# Altium schematic sheet PHENIKA.SchDoc
size A2; SheetNumber: 1; SheetTotal: 2
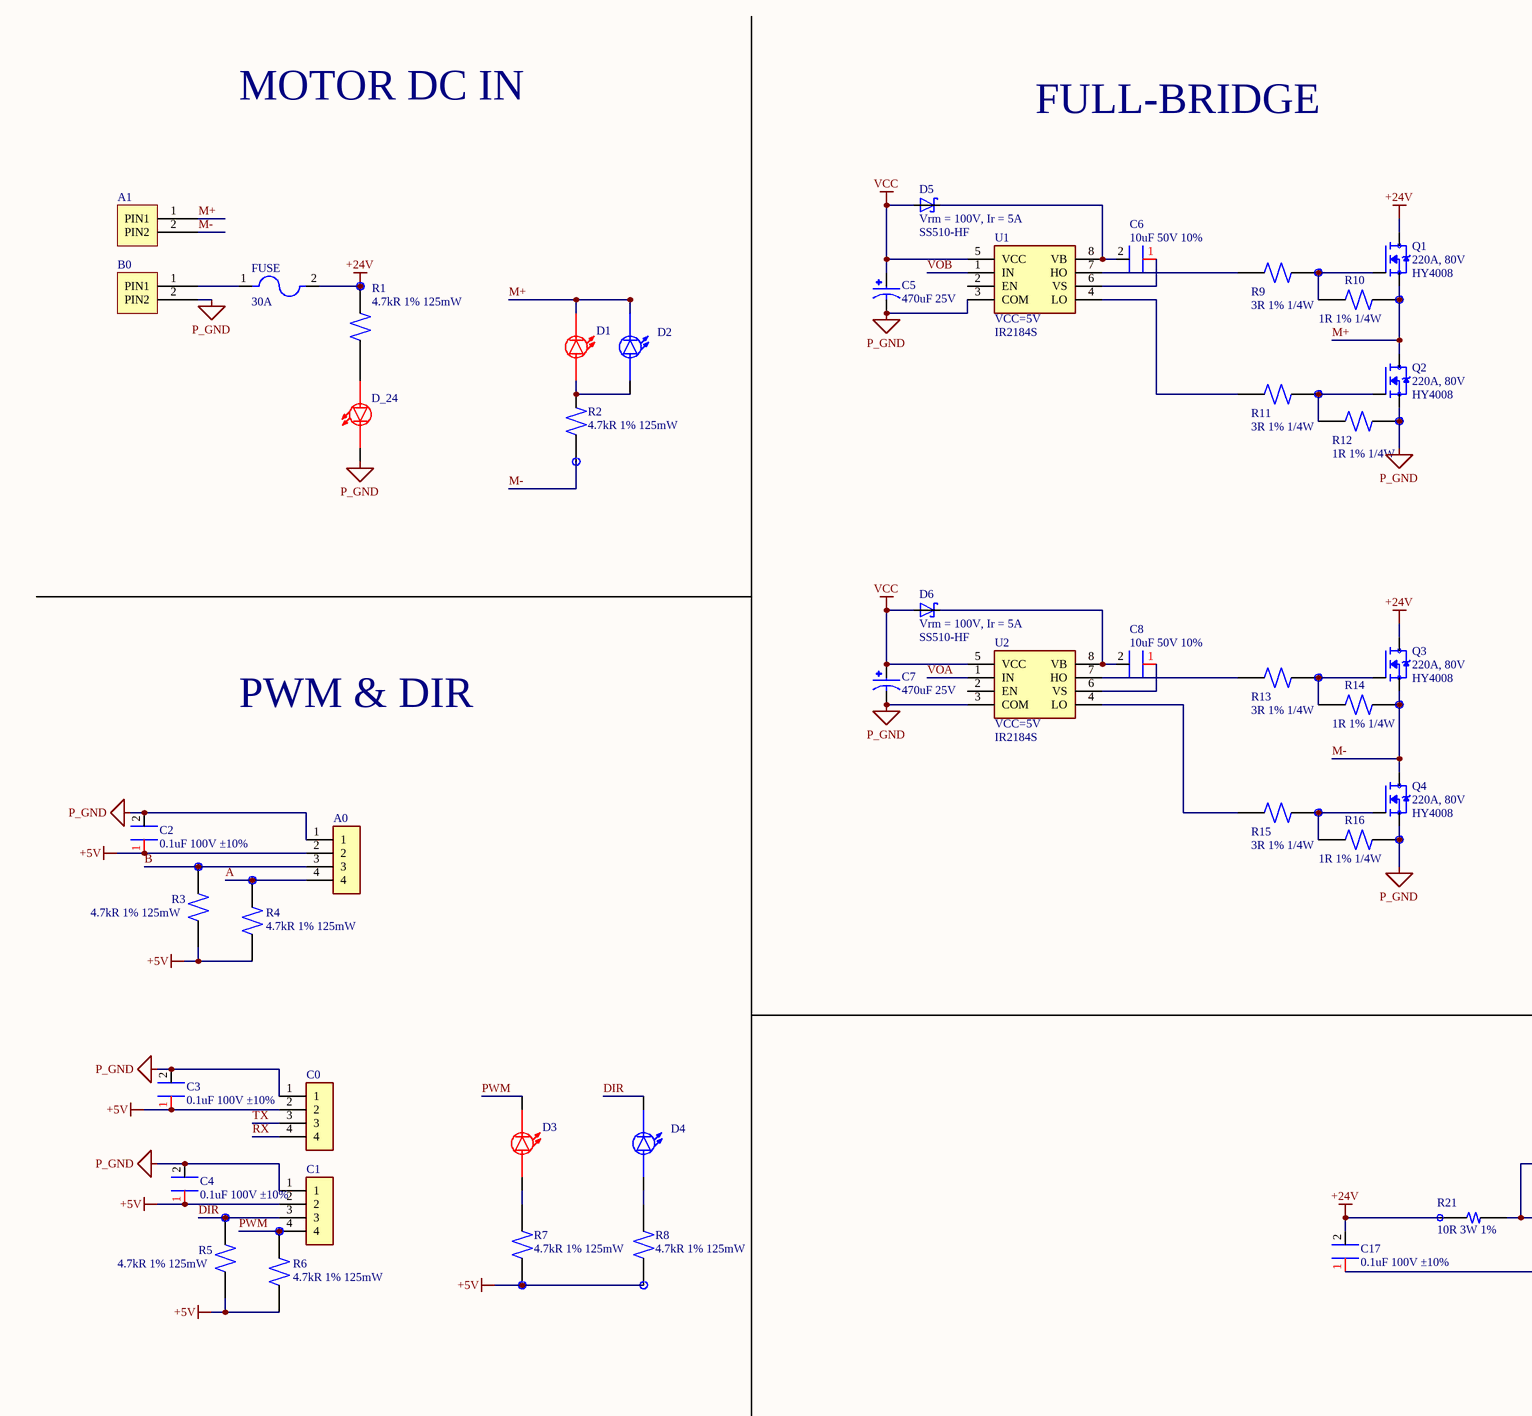
[diagram p0: PHENIKA.SchDoc, left]
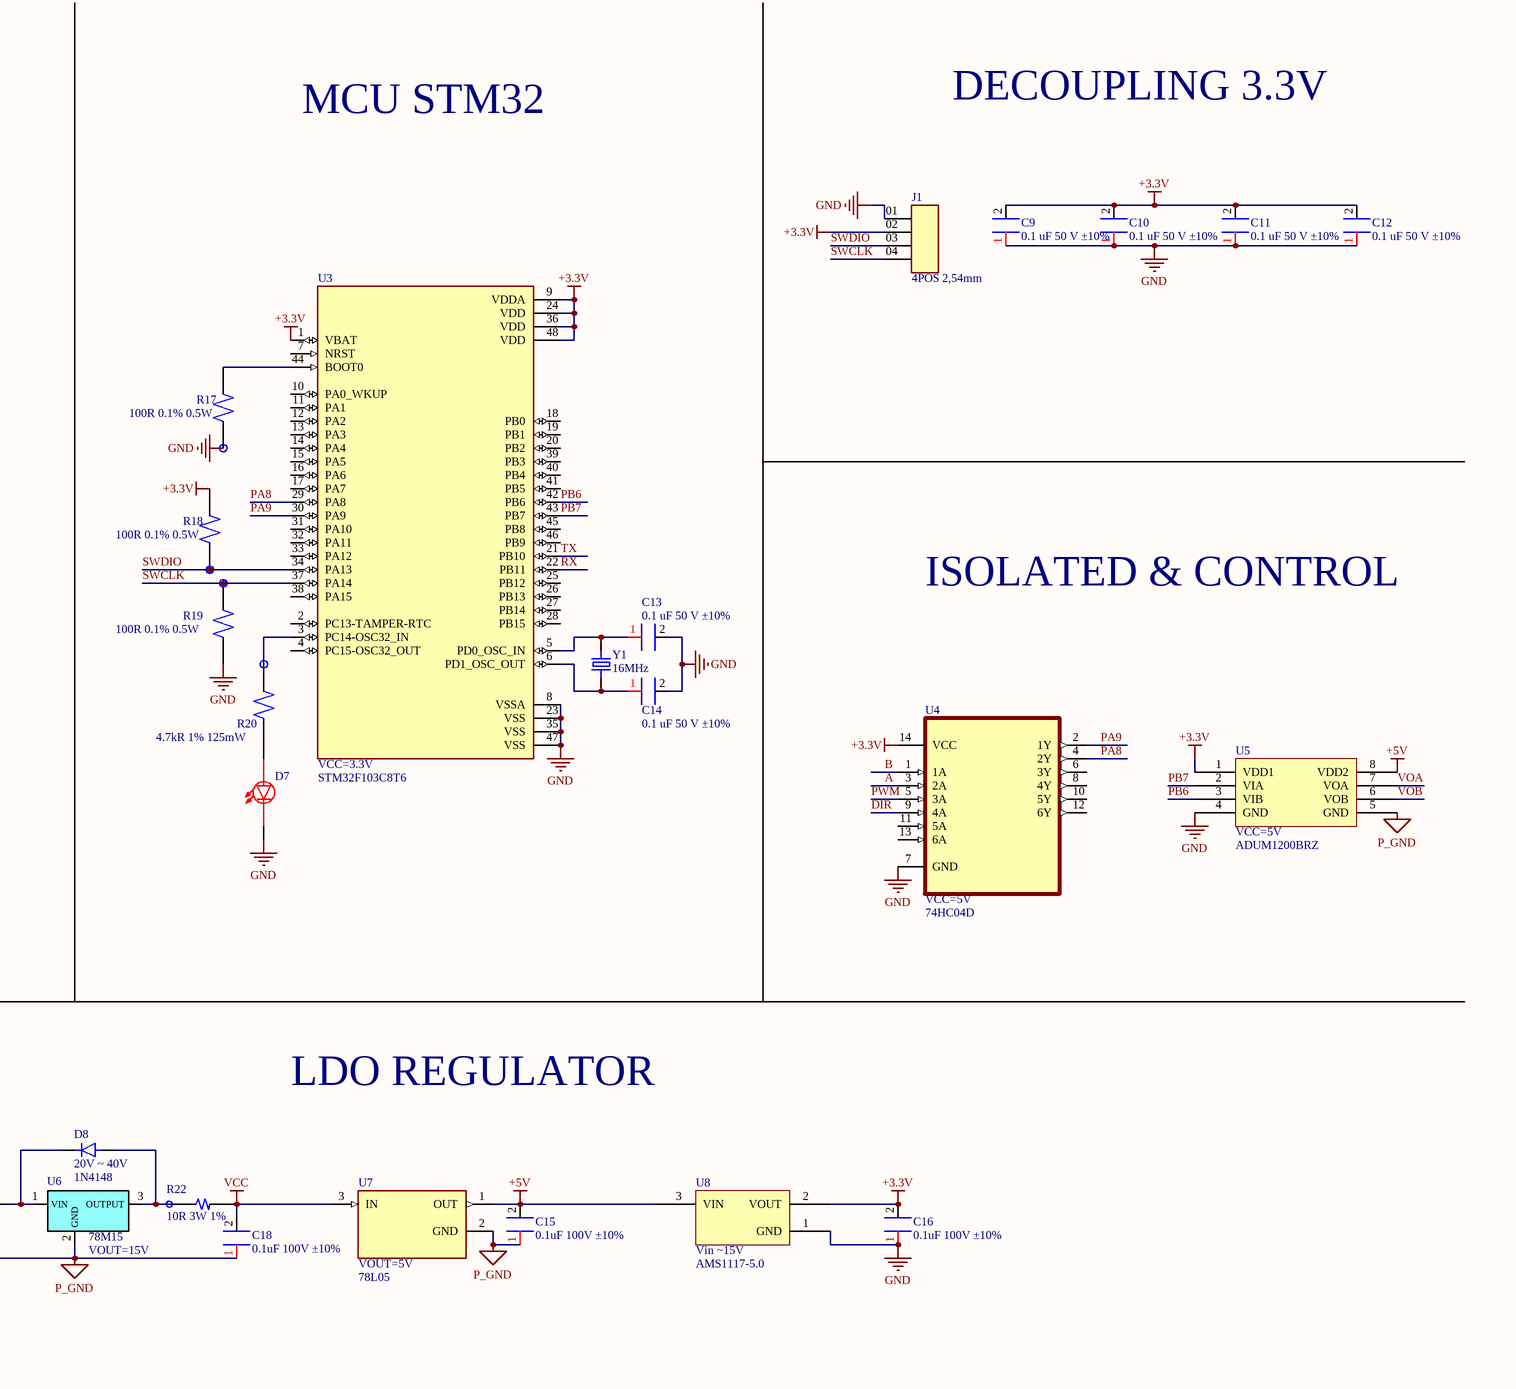
[diagram p1: PHENIKA.SchDoc, right]

## Parts
A0  4PIN 2.5 mm  [HEADER-4POS_CURVED_2.54mm]  (value not drawn)
A1  2PIN 2.54mm  [HEADER-CONN_2POS_2.54mm]  (value not drawn)
B0  2PIN 2.54mm  [HEADER-CONN_2POS_2.54mm]  (value not drawn)
C0  4PIN 2.5 mm  [HEADER-4POS_CURVED_2.54mm]  (value not drawn)
C1  4PIN 2.5 mm  [HEADER-4POS_CURVED_2.54mm]  (value not drawn)
C2  0.1uF 100V ±10%  [CAP-CER_1206 3.2x1.6x0.5mm SMD]
C3  0.1uF 100V ±10%  [CAP-CER_1206 3.2x1.6x0.5mm SMD]
C4  0.1uF 100V ±10%  [CAP-CER_1206 3.2x1.6x0.5mm SMD]
C5  470uF 25V  [CAP-POLARIZED TH 25V 3x5mm]
C6  10uF 50V 10%  [CAP-CER_0805 SMD 2.01x1.25mm]
C7  470uF 25V  [CAP-POLARIZED TH 25V 3x5mm]
C8  10uF 50V 10%  [CAP-CER_0805 SMD 2.01x1.25mm]
C9  0.1 uF 50 V ±10%  [CAP-CER_0805 SMD 2.01x1.25mm]
C10  0.1 uF 50 V ±10%  [CAP-CER_0805 SMD 2.01x1.25mm]
C11  0.1 uF 50 V ±10%  [CAP-CER_0805 SMD 2.01x1.25mm]
C12  0.1 uF 50 V ±10%  [CAP-CER_0805 SMD 2.01x1.25mm]
C13  0.1 uF 50 V ±10%  [CAP-CER_0805 SMD 2.01x1.25mm]
C14  0.1 uF 50 V ±10%  [CAP-CER_0805 SMD 2.01x1.25mm]
C15  0.1uF 100V ±10%  [CAP-CER_1206 3.2x1.6x0.5mm SMD]
C16  0.1uF 100V ±10%  [CAP-CER_1206 3.2x1.6x0.5mm SMD]
C17  0.1uF 100V ±10%  [CAP-CER_1206 3.2x1.6x0.5mm SMD]
C18  0.1uF 100V ±10%  [CAP-CER_1206 3.2x1.6x0.5mm SMD]
D1  XL-1608SURC-06  [DIODE-LED_SMD-XL-1608SURC-06 RED 1.25x1.14mm]  (value not drawn)
D2  LED BLUE  [DIODE-LED_SMD-LXT0805GW-TR 1.25X1.14MM]  (value not drawn)
D3  XL-1608SURC-06  [DIODE-LED_SMD-XL-1608SURC-06 RED 1.25x1.14mm]  (value not drawn)
D4  LED BLUE  [DIODE-LED_SMD-LXT0805GW-TR 1.25X1.14MM]  (value not drawn)
D5  Vrm = 100V, Ir = 5A  Manufacture Part Number Cross: SS510-HF  [DIODE_ES1J-DO214AC]
D6  Vrm = 100V, Ir = 5A  Manufacture Part Number Cross: SS510-HF  [DIODE_ES1J-DO214AC]
D7  XL-1608SURC-06  [DIODE-LED_SMD-XL-1608SURC-06 RED 1.25x1.14mm]  (value not drawn)
D8  20V ~ 40V  Manufacturer Part Number: 1N4148  [DIODE-SCHOTTKY_1N4148 5x2.4x1.2mm]
D_24  XL-1608SURC-06  [DIODE-LED_SMD-XL-1608SURC-06 RED 1.25x1.14mm]  (value not drawn)
FUSE  30A  [FUSE-30A-250V-DIP]
J1  4POS 2,54mm  [JUMP_4POS_TH_NO-BODY]  (no BOM)
Q1  220A, 80V  Manufacturer Part Number: HY4008  [MOSFET_N-CHANNEL_TO-263-2]
Q2  220A, 80V  Manufacturer Part Number: HY4008  [MOSFET_N-CHANNEL_TO-263-2]
Q3  220A, 80V  Manufacturer Part Number: HY4008  [MOSFET_N-CHANNEL_TO-263-2]
Q4  220A, 80V  Manufacturer Part Number: HY4008  [MOSFET_N-CHANNEL_TO-263-2]
R1  4.7kR 1% 125mW  [RES_0805 2x1.25mm]
R2  4.7kR 1% 125mW  [RES_0805 2x1.25mm]
R3  4.7kR 1% 125mW  [RES_0805 2x1.25mm]
R4  4.7kR 1% 125mW  [RES_0805 2x1.25mm]
R5  4.7kR 1% 125mW  [RES_0805 2x1.25mm]
R6  4.7kR 1% 125mW  [RES_0805 2x1.25mm]
R7  4.7kR 1% 125mW  [RES_0805 2x1.25mm]
R8  4.7kR 1% 125mW  [RES_0805 2x1.25mm]
R9  3R 1% 1/4W  [RES_0805 2x1.25mm]
R10  1R 1% 1/4W  [RES_0805 2x1.25mm]
R11  3R 1% 1/4W  [RES_0805 2x1.25mm]
R12  1R 1% 1/4W  [RES_0805 2x1.25mm]
R13  3R 1% 1/4W  [RES_0805 2x1.25mm]
R14  1R 1% 1/4W  [RES_0805 2x1.25mm]
R15  3R 1% 1/4W  [RES_0805 2x1.25mm]
R16  1R 1% 1/4W  [RES_0805 2x1.25mm]
R17  100R 0.1% 0.5W  [RES_0805 2x1.25mm]
R18  100R 0.1% 0.5W  [RES_0805 2x1.25mm]
R19  100R 0.1% 0.5W  [RES_0805 2x1.25mm]
R20  4.7kR 1% 125mW  [RES_0805 2x1.25mm]
R21  10R 3W 1%  [RES_2512 SMD 6.3x2.15x0.7mm]
R22  10R 3W 1%  [RES_2512 SMD 6.3x2.15x0.7mm]
U1  VCC=5V  Manufacturer Part Number: IR2184S  [IC_OP-AMP_MAX4213_SOIC8]
U2  VCC=5V  Manufacturer Part Number: IR2184S  [IC_OP-AMP_MAX4213_SOIC8]
U3  VCC=3.3V  Manufacturer Part Number: STM32F103C8T6  [MCU_STM32F103C8T6_LQFP-48]
U4  VCC=5V  Manufacturer Part Number: 74HC04D  [IC_74HC04D_SOIC-14]
U5  VCC=5V  Manufacturer Part Number: ADUM1200BRZ  [IC-HALL-SENSOR_ACS712-SOIC-8]
U6  VOUT=15V  Manufacture Part Number Cross: 78M15  [IC_LDO_TO-252_78M15]
U7  VOUT=5V  Manufacturer Part Number: 78L05  [IC_HT7233-SOT89]
U8  Vin ~15V  Manufacturer Part Number: AMS1117-5.0  [IC_HT7533-3_SOT89]
Y1  16MHz  [OSCILATOR-4.9152 MHz]

## Nets
+3.3V: C9.2 C10.2 C11.2 C12.2 C16.2 J1.02 R18.2 U3.1(VBAT) U3.9(VDDA) U3.24(VDD) U3.36(VDD) U3.48(VDD) U4.14(VCC) U5.1(VDD1) U8.2(VOUT)
+5V: A0.2 C0.2 C1.2 C2.1 C3.1 C4.1 C15.2 R3.2 R4.2 R5.2 R6.2 R7.1 R8.1 U5.8(VDD2) U7.1(OUT) U8.3(VIN)
+24V: C17.2 FUSE.2 Q1.3(D) Q3.3(D) R1.1 R21.1
GND: C9.1 C10.1 C11.1 C12.1 C13.2 C14.2 C16.1 D7.C J1.01 R17.1 R19.2 U3.8(VSSA) U3.23(VSS) U3.35(VSS) U3.47(VSS) U4.7(GND) U5.4(GND) U8.1(GND)
P_GND: A0.1 B0.2(PIN2) C0.1 C1.1 C2.2 C3.2 C4.2 C5.2 C7.2 C15.1 C17.1 C18.1 D_24.C Q2.2(S) Q4.2(S) R12.1 R16.1 U1.3(COM) U2.3(COM) U5.5(GND) U6.2(GND) U7.2(GND)
VCC: C5.1 C7.1 C18.2 D5.A D6.A R22.2 U1.5(VCC) U2.5(VCC) U7.3(IN)
A: A0.4 R4.1 U4.3(2A)
B: A0.3 R3.1 U4.1(1A)
DIR: C1.3 D4.C R5.1 U4.9(4A)
M+: A1.1(PIN1) D1.C D2.C Q1.2(S) Q2.3(D) R10.1
M-: A1.2(PIN2) Q3.2(S) Q4.3(D) R2.1 R14.1
PA8: U3.29(PA8) U4.4(2Y)
PA9: U3.30(PA9) U4.2(1Y)
PB6: U3.42(PB6) U5.3(VIB)
PB7: U3.43(PB7) U5.2(VIA)
PWM: C1.4 D3.C R6.1 U4.5(3A)
RX: C0.4 U3.22(PB11)
SWCLK: J1.04 R19.1 U3.37(PA14)
SWDIO: J1.03 R18.1 U3.34(PA13)
TX: C0.3 U3.21(PB10)
VOA: U2.1(IN) U5.7(VOA)
VOB: U1.1(IN) U5.6(VOB)
NetB0_1: B0.1(PIN1) FUSE.1
NetC6_1: C6.1 U1.6(VS)
NetC6_2: C6.2 D5.C U1.8(VB)
NetC8_1: C8.1 U2.6(VS)
NetC8_2: C8.2 D6.C U2.8(VB)
NetC13_1: C13.1 U3.5(PD0_OSC_IN) Y1.2
NetC14_1: C14.1 U3.6(PD1_OSC_OUT) Y1.1
NetD1_A: D1.A D2.A R2.2
NetD3_A: D3.A R7.2
NetD4_A: D4.A R8.2
NetD7_A: D7.A R20.2
NetD8_A: D8.A R22.1 U6.3(OUTPUT)
NetD8_K: D8.K R21.2 U6.1(VIN)
NetD_24_A: D_24.A R1.2
NetQ1_1: Q1.1(G) R9.1 R10.2
NetQ2_1: Q2.1(G) R11.1 R12.2
NetQ3_1: Q3.1(G) R13.1 R14.2
NetQ4_1: Q4.1(G) R15.1 R16.2
NetR9_2: R9.2 U1.7(HO)
NetR11_2: R11.2 U1.4(LO)
NetR13_2: R13.2 U2.7(HO)
NetR15_2: R15.2 U2.4(LO)
NetR17_2: R17.2 U3.44(BOOT0)
NetR20_1: R20.1 U3.3(PC14-OSC32_IN)

Not connected (* = marked no-connect by the designer): U1 2(EN); U2 2(EN); U3 2(PC13-TAMPER-RTC) 4(PC15-OSC32_OUT) 7(NRST) 10(PA0_WKUP) 11(PA1) 12(PA2) 13(PA3) 14(PA4) 15(PA5) 16(PA6) 17(PA7) 18(PB0) 19(PB1) 20(PB2) 25(PB12) 26(PB13) 27(PB14) 28(PB15) 31(PA10) 32(PA11) 33(PA12) 38(PA15) 39(PB3) 40(PB4) 41(PB5) 45(PB8) 46(PB9); U4 6(3Y) 8(4Y) 10(5Y) 11(5A) 12(6Y) 13(6A)

## Notes on the sheet
- MOTOR DC IN
- FULL-BRIDGE
- MCU STM32
- DECOUPLING 3.3V
- ISOLATED & CONTROL
- PWM & DIR
- LDO REGULATOR
- Lần
- Nội dung thay đổi
- Ngày
- Vật liệu:
- Khối lượng:
- Số lượng:
- Sheet:
- Tên bản vẽ:
- Mã LK bản vẽ:
- Thiết kế
- Kiểm tra
- Phê duyệt
- Tên sản phẩm:
- Đơn vị
- Mã sản phẩm:
- Phiên bản
- Tỷ lệ
- Trang
- MINH REUS

## Library data of the parts
A0 C0 C1 = HEADER _4PIN;TH CURVED;2.54mm: Connector Header Through Hole, Right Angle 4 position 0.079" (2.00mm); Manufacturer Part Number: S4B-PH-K-S; Manufacturer: JST Sales America Inc.; Link in VN: NA; Library Make By: Minh Reus; Link: https://www.digikey.com/en/products/detail/jst-sales-america-inc/S4B-PH-K-S/926628; Package: TH; Values: 4PIN 2.5 mm; Manufacture Cross: JST Sales America Inc.; Manufacture Part Number Cross: S4B-PH-K-S; Price: 0.09 USD; ComponentLink1Description: Link Datasheet; ComponentLink1URL: https://www.jst-mfg.com/product/pdf/eng/ePH.pdf; ComponentLink2Description: Link Cross; ComponentLink2URL: https://www.digikey.com/en/products/detail/jst-sales-america-inc/S4B-PH-K-S/926628; ComponentLink3Description: Link Original; ComponentLink3URL: https://www.digikey.com/en/products/detail/jst-sales-america-inc/S4B-PH-K-S/926628
A1 B0 = HEADER 2 PIN;TH;2.54mm: CONN HEADER VERT 2POS 2.5MM; Manufacturer Part Number: JST Sales America Inc.; Manufacturer: B2B-XH-A; Link in VN: NA; Library Make By: Minh Reus; Link: https://www.digikey.com/en/products/detail/jst-sales-america-inc/B2B-XH-A/1651045; Package: TH; Values: 2PIN 2.54mm; Manufacture Cross: JST Sales America Inc.; Manufacture Part Number Cross: B2B-XH-A; Price: 0.054 USD; ComponentLink1Description: Link Datasheet; ComponentLink1URL: https://www.jst-mfg.com/product/pdf/eng/eXH.pdf; ComponentLink2Description: Link Cross; ComponentLink2URL: https://www.digikey.com/en/products/detail/jst-sales-america-inc/B2B-XH-A/1651045; ComponentLink3Description: Link Original; ComponentLink3URL: https://www.digikey.com/en/products/detail/jst-sales-america-inc/B2B-XH-A/1651045
C2-C4 C15-C18 = CAP_CER; SMD; 0.1uF 100V ±10%;1206;: Multilayer Ceramic Capacitor, 0.1 uF, 100 V, ± 10%, X7R, 1206 [3216 Metric]; Manufacturer: Yageo; Manufacturer Part Number: CC1206KKX7R0BB104; Manufacture Cross: KYOCERA AVX; Manufacture Part Number Cross: KAM21BR71H104JT; Library Make By: Minh Reus; Price: 0.0142 USD; Package: 1206; Value: 0.1uF 100V 10%; ComponentLink1URL: https://datasheet.ciiva.com/7978/1447671-7978227.pdf?src-supplier=Element14; ComponentLink1Description: Link Datasheet; ComponentLink2URL: https://www.digikey.com/en/products/detail/yageo/CC1206KKX7R0BB104/2833653?s=N4IgTCBcDaIMJwIxgAwDYDSGAaB2ASigEJGIoAsIAugL5A; ComponentLink2Description: Link Original; ComponentLink3URL: https://www.mouser.vn/ProductDetail/KYOCERA-AVX/KAM21BR71H104JT?qs=Jm2GQyTW%2Fbic6Zk4McEt6w%3D%3D; ComponentLink3Description: Link Cross; Link: https://www.digikey.com/en/products/detail/yageo/CC1206KKX7R0BB104/2833653?s=N4IgTCBcDaIMJwIxgAwDYDSGAaB2ASigEJGIoAsIAugL5A
C5 C7 = CAP_ALUM;TH;470µF 25V: CAP_ALUM;TH;EEU-TP1E471LB;470µF 25V Aluminum Electrolytic Capacitors Radial, Can 2000 Hrs @ 125Â°C; Manufacturer: Panasonic; Manufacturer Part Number: EEUTP1E471LB; Manufacture Cross: Chemi-Con; Manufacture Part Number Cross: ELXZ250ETD471MJ16S; Library Make By: Minh Reus; Package: RADIAL-2 Panasonic; Value: 470µF 25V; Link: https://www.digikey.com/en/products/detail/rubycon/25ZLH470MEFC10X12-5/3563614; ComponentLink1Description: Link Datasheet; ComponentLink1URL: https://www.snapeda.com/parts/EEUTP1E471LB/Panasonic/datasheet/; ComponentLink2Description: Link Original; ComponentLink2URL: https://www.digikey.com/en/products/detail/rubycon/25ZLH470MEFC10X12-5/3563614; ComponentLink3Description: Link Cross; ComponentLink3URL: https://www.mouser.com/ProductDetail/Chemi-Con/ELXZ250ETD471MJ16S?qs=sGAEpiMZZMvwFf0viD3Y3VB9d1HDLyfsesaxNYKOGms%3D; Price: 0.10213 USD
C6 C8 = CAP_CER;10uF 50V 10%;SMD;0805: Ceramic Capacitor, Multilayer, Ceramic, 50V, 10% +Tol, 10% -Tol, X5R, 10uF, Surface Mount, 0805; Manufacturer: Murata; Manufacturer Part Number: GRM21BR61H106KE43K; Manufacture Cross: SANYEAR; Manufacture Part Number Cross: C0805X5R106K500NT; Library Make By: Minh Reus; Package: 0805; Value: 10uF 50V 10%; ComponentLink1URL: https://datasheet.octopart.com/GRM21BR61H106KE43K-Murata-datasheet-155239205.pdf?src-supplier=Newark; ComponentLink1Description: Link Datasheet; ComponentLink2URL: https://www.lcsc.com/product-detail/Multilayer-Ceramic-Capacitors-MLCC-SMD-SMT_SANYEAR-C0805X5R106K500NT_C962154.html; ComponentLink2Description: Link Cross; ComponentLink3URL: https://www.digikey.com/en/products/detail/murata-electronics/GRM21BR61H106KE43K/15191954; ComponentLink3Description: Link Original; Price: 0.0679 USD; Link: https://www.digikey.com/en/products/detail/murata-electronics/GRM21BR61H106KE43K/15191954
C9-C14 = CAP_CER; SMD; 0.1uF 50V ±10%;0805;: Multilayer Ceramic Capacitor, 0.1 uF, 50 V, ± 10%, X7R, 0805 [2012 Metric]; Manufacturer: Kyocera AVX; Manufacturer Part Number: 08055C104K4T4A; Manufacture Cross: Vishay; Manufacture Part Number Cross: VJ0805Y104KBABE31; Library Make By: Minh Reus; Price: 0.0241 USD; Package: 0805; Value: 0.1uF 50V 10%; ComponentLink1URL: https://datasheet.ciiva.com/26904/getdatasheetpartid-74229-26904224.pdf?src-supplier=Verical; ComponentLink1Description: Link Datasheet; ComponentLink2URL: https://www.digikey.com/en/products/detail/kyocera-avx/08055C104K4T4A/1602855; ComponentLink2Description: Link Original; ComponentLink3URL: https://www.mouser.vn/ProductDetail/Vishay-Vitramon/VJ0805Y104KBABE31?qs=TLaLXeh6c70yB%252BsdRZoYCQ%3D%3D; ComponentLink3Description: Link Cross; Link: https://www.digikey.com/en/products/detail/kyocera-avx/08055C104K4T4A/1602855
D1 D3 D7 D_24 = DIODE_LED;SMD;RED COLOUR: DIODE_LED;SMD;RED COLOUR; XL-1608SURC-06; / 25mA ; -30℃~+85℃ Positive post 617nm~621nm Red 120° 55mW 0805 Light Emitting Diodes (LED) ROHS; Manufacturer: XINGLIGHT; Manufacture Cross: Würth Elektronik; Manufacture Part Number Cross: 150080BS75000; Values: NA; Library Make By: Minh Reus; Manufacturer Part Number: XL-1608SURC-06; Link: https://www.lcsc.com/product-detail/Light-Emitting-Diodes-LED_XINGLIGHT-XL-1608SURC-06_C965799.html; Link in VN: NA; Package: SMD 0805; Price: 0.131 USD; ComponentLink1Description: New link; ComponentLink1URL: *; ComponentLink2Description: New link; ComponentLink2URL: *; ComponentLink3Description: New link; ComponentLink3URL: *
D2 D4 = DIODE_LED;SMD; BLUE COLOR: DIODE_LED;SMD;SML-LXT0805GW-TR;Blue LED Indication - Discrete 2V 0805 _2012 Metric_; Manufacturer Part Number: Dialight; Manufacture Cross: Würth Elektronik; Manufacture Part Number Cross: 150080BS75000; Value: NA; Library Make By: Minh Reus; Link: https://www.digikey.com/en/products/detail/dialight/5988191107F/1291280?s=N4IgTCBcDaIKwE4AcBaJBGB6XoAwHYAxEAXQF8g; Package: 0805; Manufacturer: SML-LXT0805GW-TR; Price: 0.131 USD; ComponentLink1Description: Link Original; ComponentLink1URL: https://www.digikey.com/en/products/detail/dialight/5988191107F/1291280?s=N4IgTCBcDaIKwE4AcBaJBGB6XoAwHYAxEAXQF8g; ComponentLink2Description: Link Datasheet; ComponentLink2URL: https://www.we-online.com/components/products/datasheet/150080BS75000.pdf; ComponentLink3Description: Link Cross; ComponentLink3URL: https://www.digikey.com/en/products/detail/w%C3%BCrth-elektronik/150080BS75000/4489912
D5 D6 = DIODE_SCHOTTKY;Vrm = 100V, Ir =5A;SMD;SMA: Schottky Diodes & Rectifiers DIODE SCHOTTKY 5A 100V SMA; Manufacturer: Comchip Technology; Library Make By: Minh Reus; Link: https://www.mouser.vn/ProductDetail/Comchip-Technology/SS510-HF?qs=GBLSl2AkirsMVpU1ZRGkfw%3D%3D&srsltid=AfmBOoqTrEXZEOHdxyu_vwDjEPmhjmMHx1om89Gm_MeteyTegoUhiyJ3; Package: SMA (DO-214AC); Manufacturer Part Number: SS510-HF; Value: Vrm = 100V, Ir = 5A; Manufacture Cross: Comchip Technology; Price: 0.12 USD; ComponentLink1Description: Link Datasheet; ComponentLink1URL: https://www.mouser.vn/ProductDetail/Comchip-Technology/SS510-HF?qs=GBLSl2AkirsMVpU1ZRGkfw%3D%3D&srsltid=AfmBOoqTrEXZEOHdxyu_vwDjEPmhjmMHx1om89Gm_MeteyTegoUhiyJ3; ComponentLink2Description: Link Original; ComponentLink2URL: https://www.mouser.vn/ProductDetail/Comchip-Technology/SS510-HF?qs=GBLSl2AkirsMVpU1ZRGkfw%3D%3D&srsltid=AfmBOoqTrEXZEOHdxyu_vwDjEPmhjmMHx1om89Gm_MeteyTegoUhiyJ3; ComponentLink3Description: Link Cross; ComponentLink3URL: https://www.mouser.vn/ProductDetail/Comchip-Technology/SS510-HF?qs=GBLSl2AkirsMVpU1ZRGkfw%3D%3D&srsltid=AfmBOoqTrEXZEOHdxyu_vwDjEPmhjmMHx1om89Gm_MeteyTegoUhiyJ3
D8 = DIODE_SCHOTTKY; SMD;: DIODE SCHOTTKY; SMD; VCC 20V-->40V; Manufacturer: CHENMKO ENTERPRISE; Manufacture Cross: Vishay Semiconductors; Manufacture Part Number Cross: BAT54WS-HE3-08; Library Make By: Minh Reus; Link: https://www.digchip.net/datasheets/parts/datasheet/882/LL340PT.php; Link in VN: https://linhkienchatluong.vn/diode-chinh-luu/diode-1n4148-sot-80-smd-loai-thuong-day-500c_sp572_ct8027.aspx; Package: SOT-80; Value: 20V ~ 40V; ComponentLink1Description: Link Datasheet; ComponentLink1URL: https://www.vishay.com/docs/85667/bat54ws.pdf; ComponentLink2Description: Link Cross; ComponentLink2URL: https://www.mouser.vn/ProductDetail/Vishay-Semiconductors/BAT54WS-HE3-08?qs=ESFF34Uzhwit1TO6n98Cjg%3D%3D&mgh=1&utm_id=21163026226&gad_source=1&gclid=Cj0KCQjwq_G1BhCSARIsACc7Nxq-ByYxpFlbPIIvX67EumUAu1MSEoCGJu52P8TCuTLh4yWmNT1_8AoaAmsOEALw_wcB; ComponentLink3Description: Link Original; ComponentLink3URL: https://www.digchip.net/datasheets/parts/datasheet/882/LL340PT.php; Price: 0.051 USD
FUSE = FUSE;TH;30A-250V: FUSE;TH;5A;5ETP 1-R (0655R1000-13) | Glass Tube Fuse | 5x20mm | IEC Low Break | Time Lag | High Surge | 1A; Manufacturer: BEL FUSE; Manufacturer Part Number: FC-201; Library Make By: Minh Reus; Package: DIP; Value: 5A; Link: https://www.belfuse.com/product/part-details?partn=FC-201-BRIGHT-TIN; Manufacture Cross: BEL FUSE; Manufacture Part Number Cross: FC-201; Price: 0.292 USD; ComponentLink1Description: Link Datasheet; ComponentLink1URL: https://www.belfuse.com/product/part-details?partn=FC-201-BRIGHT-TIN; ComponentLink2Description: Link Cross; ComponentLink2URL: https://www.belfuse.com/product/part-details?partn=FC-201-BRIGHT-TIN; ComponentLink3Description: Link Original; ComponentLink3URL: https://www.belfuse.com/product/part-details?partn=FC-201-BRIGHT-TIN
J1 = JUMP_4POS;TH;2.54;NO-BODY: CONN HEADER VERT 4POS 2.54MM; Manufacture: Samtec; Manufacture Part Number: HMTSW-104-08-S-S-280; Manufacture Part Number Cross: HMTSW-104-08-G-S-250; Value: NA; Library Make By: Minh Reus; Link: https://www.snapeda.com/parts/HMTSW-104-08-S-S-280/Samtec/view-part/?ref=snap; Package: TH; Manufacture Cross: Samtec; Price: 1.06 USD; ComponentLink1Description: Link Datasheet; ComponentLink1URL: https://www.digikey.com/en/products/detail/samtec-inc/HMTSW-104-08-G-S-250/8450805; ComponentLink2Description: Link Cross; ComponentLink2URL: https://www.digikey.com/en/products/detail/samtec-inc/HMTSW-104-08-G-S-250/8450805; ComponentLink3Description: Link Original; ComponentLink3URL: https://www.digikey.com/en/products/detail/samtec-inc/HMTSW-104-08-G-S-250/8450805
Q1-Q4 = MOSFET POWER;SMD; N-channel;TO-263-2;HY4008: Technical Specifications: / Type Designator: HY4008A / Type of Transistor: MOSFET / Type of Control Channel: N -Channel / Maximum Power Dissipation (Pd): 397 W / Maximum Drain-Source Voltage |Vds|: 80 V / Maximum Gate-Source Voltage |Vgs|: 25 V / Maximum Gate-Threshold Voltage |Vgs(th)|: 4 V / Maximum Drain Current |Id|: 200 A; Manufacturer: HOOYI SEMICONDUCTOR; Library Make By: Minh Reus; Package: TO-263-2; Value: 220A, 80V; Link: https://www.bdtronics.com/hy4008-smd-80v-200a-n-channel-enhancement-mode-power-mosfet-to-263.html; Manufacture Cross: HOOYI SEMICONDUCTOR; Manufacture Part Number Cross: HY4008; Price: 0.5 USD; ComponentLink1Description: Link Datasheet; ComponentLink1URL: https://www.bdtronics.com/hy4008-smd-80v-200a-n-channel-enhancement-mode-power-mosfet-to-263.html; ComponentLink2Description: Link Original; ComponentLink2URL: https://www.bdtronics.com/hy4008-smd-80v-200a-n-channel-enhancement-mode-power-mosfet-to-263.html; ComponentLink3Description: Link Cross; ComponentLink3URL: https://www.bdtronics.com/hy4008-smd-80v-200a-n-channel-enhancement-mode-power-mosfet-to-263.html
R1-R8 R20 = RES;SMD;4.7kR 0.1% 125mW ;0805;: RES;SMD;4.7kR 0.1%;0805; / 125mW Thick Film Resistors 150V ±100ppm/℃ ±1% 4.7kΩ 0805 Chip Resistor - Surface Mount ROHS; Manufacturer: UNI-ROYAL(Uniroyal Elec); Manufacturer Part Number: 0805W8F4701T5E; Manufacture Cross: Royalohm; Library Make By: Minh Reus; Link: https://www.lcsc.com/product-detail/Chip-Resistor-Surface-Mount-UniOhm_4-7KR-4701-1_C17673.html; Package: 0805; Value: 4.7kR 1% 125mW; Manufacture Part Number Cross: 0805W8F4701T5E; Price: 0.002 USD; ComponentLink1Description: Link Datasheet; ComponentLink1URL: https://www.mouser.vn/datasheet/2/1365/1-3044649.pdf; ComponentLink2Description: Link Original; ComponentLink2URL: https://www.lcsc.com/product-detail/Chip-Resistor-Surface-Mount-UniOhm_4-7KR-4701-1_C17673.html; ComponentLink3Description: Link Cross; ComponentLink3URL: https://www.mouser.in/ProductDetail/Royalohm/0805W8F4701T5E?qs=e8oIoAS2J1RsbupGwbBZOQ%3D%3D
R9-R16 = RES;SMD;0R 1%;0805: RES;SMD;0R 1%;0805; Thick Film Resistors - SMD 1/4watt 0ohms; Manufacturer Part Number: CRCW12060000Z0EA; Manufacturer: Vishay / Dale; Manufacture Cross: Bourns Inc.; Manufacture Part Number Cross: CR0805AJ/-000EAS; Link in VN: NA; Values: 0R 1% 1/4W; Library Make By: Minh Reus; Link: https://www.mouser.vn/ProductDetail/Vishay-Dale/CRCW12060000Z0EA?qs=9Ncj7kJVcvc4chyizblTYQ%3D%3D; Package: 0805; Price: 0.01093 USD; ComponentLink1Description: Link Original; ComponentLink1URL: https://www.mouser.vn/ProductDetail/Vishay-Dale/CRCW12060000Z0EA?qs=9Ncj7kJVcvc4chyizblTYQ%3D%3D; ComponentLink2Description: Link Cross; ComponentLink2URL: https://www.digikey.com/en/products/detail/bourns-inc/CR0805AJ-000EAS/10240129; ComponentLink3Description: Link Datasheet; ComponentLink3URL: https://www.bourns.com/docs/product-datasheets/cr-a-as.pdf
R17-R19 = RES; SMD; 120R 0.1% 0.5W;0805: Thick Film Resistors 0805 120ohms 0.5W 0.5% AEC-Q200; Manufacturer Part Number: ERJ-P06D1200V; Manufacturer: Panasonic; Value: 120R 0.1% 1/10W; Library Make By: Minh Reus; Link: https://www.mouser.com/ProductDetail/Panasonic/ERJ-P06D1200V?qs=sGAEpiMZZMvdGkrng054tzSGWtpoOZZIMqKhr0RuMnQ%3D; Package: 0805; Manufacture Part Number Cross: ERJ-P06D1200V; Manufacture Cross: Panasonic; Price: 0.0333 USD; ComponentLink1Description: Link Cross; ComponentLink1URL: https://www.mouser.com/datasheet/2/315/AOA0000C331-1141874.pdf; ComponentLink2Description: Link Original; ComponentLink2URL: https://www.mouser.com/ProductDetail/Panasonic/ERJ-P06D1200V?qs=sGAEpiMZZMvdGkrng054tzSGWtpoOZZIMqKhr0RuMnQ%3D; ComponentLink3Description: Link Datasheet; ComponentLink3URL: https://www.mouser.com/ProductDetail/Panasonic/ERJ-P06D1200V?qs=sGAEpiMZZMvdGkrng054tzSGWtpoOZZIMqKhr0RuMnQ%3D
R21 R22 = RES;SMD;12R 3W 1%;2512: RES;SMD;12R 3W 1%; 2512; Manufacturer: TE Connectivity; Manufacturer Part Number: 2176231-3; Manufacture Cross: Vishay; Manufacture Part Number Cross: WSLP2512R0100FEA; Value: 12R 3W; Library Make By: Minh Reus; Package: 2512; Link: https://www.mouser.com/ProductDetail/TE-Connectivity-Holsworthy/352212RFT?qs=Rv6LVDxB0ZpBjRvkCikjIg%3D%3D; ComponentLink1Description: Link Datasheet; ComponentLink1URL: https://www.vishay.com/docs/30122/wslp.pdf; ComponentLink2Description: Link Cross; ComponentLink2URL: https://www.mouser.vn/ProductDetail/Vishay-Dale/WSLP2512R0100FEA?qs=sGAEpiMZZMvdGkrng054t2u2DJpXhHlazGJlxZby8YA%3D; ComponentLink3Description: Link Original; ComponentLink3URL: https://www.mouser.com/ProductDetail/TE-Connectivity-Holsworthy/352212RFT?qs=Rv6LVDxB0ZpBjRvkCikjIg%3D%3D; Price: 0.222 USD
U1 U2 = IC_HALF-BRIDGE_DRIVER;SMD;SOIC-8;IR2184S: Half-Bridge Gate Driver IC Non-Inverting 8-SOIC; Manufacturer: Infineon Technologies; Library Make By: Minh Reus; Value: VCC=5V; Package: 8-SOIC; Link: https://www.digikey.com/en/products/detail/infineon-technologies/IR2184S/358190; Manufacture Cross: Infineon Technologies; Manufacture Part Number Cross: IR2184S; Price: 3.5 USD; ComponentLink1Description: Link Original; ComponentLink1URL: https://www.digikey.com/en/products/detail/infineon-technologies/IR2184S/358190; ComponentLink2Description: Link Cross; ComponentLink2URL: https://www.digikey.com/en/products/detail/infineon-technologies/IR2184S/358190; ComponentLink3Description: Link Datasheet; ComponentLink3URL: https://www.digikey.com/en/products/detail/infineon-technologies/IR2184S/358190
U3 = MCU_STM32F103C8T6;SMD;LQFP48: ARM® Cortex®-M3 STM32F1 Microcontroller IC 32-Bit Single-Core 72MHz 64KB (64K x 8) FLASH; Manufacturer: STMicroelectronics; Library Make By: Minh Reus; Package: LQFP-48; Value: VCC=3.3V; Link: https://www.digikey.com/en/products/detail/microchip-technology/PIC16F877A-I-PT/480769; Manufacture Cross: STMicroelectronics; Manufacture Part Number Cross: STM32F103C8T6; Price: 4.5 USD; ComponentLink1Description: Link Datasheet; ComponentLink1URL: https://www.digikey.com/en/products/detail/stmicroelectronics/STM32F103C8T6/1646338; ComponentLink2Description: Link Cross; ComponentLink2URL: https://www.digikey.com/en/products/detail/stmicroelectronics/STM32F103C8T6/1646338; ComponentLink3Description: Link Original; ComponentLink3URL: https://www.digikey.com/en/products/detail/stmicroelectronics/STM32F103C8T6/1646338
U4 = IC_INVERTER_6CH;SMD;SOP14;74HC04D: IC INVERTER 6CH 1-INP 14SOIC Inverter IC 6 Channel 14-SOIC; Manufacturer: Toshiba Semiconductor and Storage; Link in VN: NA; Link: https://www.digikey.com/en/products/detail/toshiba-semiconductor-and-storage/74HC04D/6109168; Package: 14SOIC; Values: VCC=5V; Manufacture Cross: Toshiba Semiconductor and Storage; ComponentLink1Description: Link Datasheet; ComponentLink1URL: https://www.digikey.com/en/products/detail/toshiba-semiconductor-and-storage/74HC04D/6109168; ComponentLink2Description: Link Cross; ComponentLink2URL: https://www.digikey.com/en/products/detail/toshiba-semiconductor-and-storage/74HC04D/6109168; ComponentLink3Description: Link Original; ComponentLink3URL: https://www.digikey.com/en/products/detail/toshiba-semiconductor-and-storage/74HC04D/6109168; Manufacture Part Number Cross: 74HC04D
U5 = IC_ISOLATOR;SMD; SOIC-8;: Digital Isolators DUAL-CHANNEL DIGITAL ISOLATORS; Manufacturer: Analog Devices; Link in VN: NA; Link: https://www.mouser.com/ProductDetail/Analog-Devices/ADUM1200BRZ?qs=WIvQP4zGanjlbUTWeYvdVw%3D%3D&srsltid=AfmBOopa5CF6h1XkdOZ3kGNL_AO1nlRf9A0sc97mPR9gwVJLltuSlIjG; Package: 8SOIC; Values: VCC=5V; Manufacture Cross: Analog Devices; ComponentLink1Description: Link Datasheet; ComponentLink1URL: https://www.mouser.com/ProductDetail/Analog-Devices/ADUM1200BRZ?qs=WIvQP4zGanjlbUTWeYvdVw%3D%3D&srsltid=AfmBOopa5CF6h1XkdOZ3kGNL_AO1nlRf9A0sc97mPR9gwVJLltuSlIjG; ComponentLink2Description: Link Cross; ComponentLink2URL: https://www.mouser.com/ProductDetail/Analog-Devices/ADUM1200BRZ?qs=WIvQP4zGanjlbUTWeYvdVw%3D%3D&srsltid=AfmBOopa5CF6h1XkdOZ3kGNL_AO1nlRf9A0sc97mPR9gwVJLltuSlIjG; ComponentLink3Description: Link Original; ComponentLink3URL: https://www.mouser.com/ProductDetail/Analog-Devices/ADUM1200BRZ?qs=WIvQP4zGanjlbUTWeYvdVw%3D%3D&srsltid=AfmBOopa5CF6h1XkdOZ3kGNL_AO1nlRf9A0sc97mPR9gwVJLltuSlIjG; Manufacture Part Number Cross: ADUM1200BRZ
U6 = IC POWER_SMD;78M15;TO252: 500mA 54dB@(120Hz) Fixed 15V Positive electrode 35V TO-252-2(DPAK) Voltage Regulators - Linear, Low Drop Out (LDO) Regulators ROHS; Manufacture Cross: GOODWORK; Library Make By: Minh Reus; Value: VOUT=15V; Price: 0.231 USD; Package: TO-252-2(DPAK); Manufacturer Part Number: 78M15; Link: https://www.lcsc.com/product-detail/Linear-Voltage-Regulators-LDO_GOODWORK-78M15_C5137841.html; Manufacturer: GOODWORK; ComponentLink1Description: Link Datasheet; ComponentLink1URL: https://www.lcsc.com/product-detail/Linear-Voltage-Regulators-LDO_GOODWORK-78M15_C5137841.html; ComponentLink2Description: Link Cross; ComponentLink2URL: https://www.lcsc.com/product-detail/Linear-Voltage-Regulators-LDO_GOODWORK-78M15_C5137841.html; ComponentLink3Description: Link Original; ComponentLink3URL: https://www.lcsc.com/product-detail/Linear-Voltage-Regulators-LDO_GOODWORK-78M15_C5137841.html
U7 = IC_LDO;SMD;SOT89;78L05: PMIC - Spannungsregler - Linear Positiv Fest 1 Ausgang 100mA SOT-89; Manufacturer: UMW; Link in VN: NA; Link: https://www.digikey.at/de/products/detail/umw/78L05/17636890?srsltid=AfmBOoqz3rC4quRV_paLHSx5C8DGNC1_dqcn5gc9AfLfUEU2Sc7c43D1; Package: SOT89; Values: VOUT=5V; Manufacture Cross: UMW; ComponentLink1Description: Link Datasheet; ComponentLink1URL: https://www.digikey.at/de/products/detail/umw/78L05/17636890?srsltid=AfmBOoqz3rC4quRV_paLHSx5C8DGNC1_dqcn5gc9AfLfUEU2Sc7c43D1; ComponentLink2Description: Link Cross; ComponentLink2URL: https://www.digikey.at/de/products/detail/umw/78L05/17636890?srsltid=AfmBOoqz3rC4quRV_paLHSx5C8DGNC1_dqcn5gc9AfLfUEU2Sc7c43D1; ComponentLink3Description: Link Original; ComponentLink3URL: https://www.digikey.at/de/products/detail/umw/78L05/17636890?srsltid=AfmBOoqz3rC4quRV_paLHSx5C8DGNC1_dqcn5gc9AfLfUEU2Sc7c43D1; Manufacture Part Number Cross: 78L05
U8 = IC_LDO;5V 1A;SMD SOT223: IC LDO REG 5V 1A SOT223Linear Voltage Regulator IC Positive Fixed 1 Output 1A SOT-223s; Manufacturer: AMS; Manufacture Cross: TDSEMIC; Manufacture Part Number Cross: AMS1117-5.0(SOT89-3); Value: Vin ~15V Vout ~5V; Library Make By: Minh Reus; Link: https://www.digikey.com/en/products/detail/shenzhen-slkormicro-semicon-co-ltd/AMS1117-5-0-SOT-89/21853073; Package: SOT89-3; ComponentLink1Description: Link Datasheet; ComponentLink1URL: https://www.alldatasheet.com/view.jsp?Searchword=Ams1117-5.0%20datasheet&gad_source=1&gclid=CjwKCAjw8fu1BhBsEiwAwDrsjIofC7qCQU7c9y4SRt4N9Hx3qb2KpoFzZLAU0y4ToIm4agcv9LsfGRoC2X4QAvD_BwE; ComponentLink2Description: Link Cross; ComponentLink2URL: https://www.lcsc.com/product-detail/Voltage-Regulators-Linear-Low-Drop-Out-span-style-background-color-ff0-LDO-span-Regulators_TDSEMIC-AMS1117-5-0-SOT89-3_C22472155.html; ComponentLink3Description: Link Original; ComponentLink3URL: https://www.digikey.com/en/products/detail/shenzhen-slkormicro-semicon-co-ltd/AMS1117-5-0-SOT-89/21853073; Price: 0.0712 USD
Y1 = OSCILLATOR;16MHz; ±20ppm;ABL-16MHZ-B4Y: Crystals CRYSTAL 16MHZ 18PF T/H; Manufacturer: ABRACON; Manufacturer Part Number: ABL-16.000MHz-B4Y; Library Make By: Minh Reus; Link: https://www.mouser.vn/ProductDetail/ABRACON/ABL-16000MHz-B4Y?qs=DZ%2FvJMgWWIsyUPmWNxNaQw%3D%3D&mgh=1&utm_id=21163026226&utm_source=google&utm_medium=cpc&utm_marketing_tactic=apaccorp&gad_source=1&gclid=CjwKCAiA2cu9BhBhEiwAft6IxAV0-pRf9DSp8GGx9s2dFs8XoHzeod-fZK3EKwYZPU6Ft0uHbqXBTBoCATIQAvD_BwE; Package: TH; Value: 16MHz; Manufacture Cross: ABRACON; Manufacture Part Number Cross: ABL-16.000MHz-B4Y; Price: 0.2 USD; ComponentLink1Description: Link Datasheet; ComponentLink1URL: https://www.mouser.vn/ProductDetail/ABRACON/ABL-16000MHz-B4Y?qs=DZ%2FvJMgWWIsyUPmWNxNaQw%3D%3D&mgh=1&utm_id=21163026226&utm_source=google&utm_medium=cpc&utm_marketing_tactic=apaccorp&gad_source=1&gclid=CjwKCAiA2cu9BhBhEiwAft6IxAV0-pRf9DSp8GGx9s2dFs8XoHzeod-fZK3EKwYZPU6Ft0uHbqXBTBoCATIQAvD_BwE; ComponentLink2Description: Link Cross; ComponentLink2URL: https://www.mouser.vn/ProductDetail/ABRACON/ABL-16000MHz-B4Y?qs=DZ%2FvJMgWWIsyUPmWNxNaQw%3D%3D&mgh=1&utm_id=21163026226&utm_source=google&utm_medium=cpc&utm_marketing_tactic=apaccorp&gad_source=1&gclid=CjwKCAiA2cu9BhBhEiwAft6IxAV0-pRf9DSp8GGx9s2dFs8XoHzeod-fZK3EKwYZPU6Ft0uHbqXBTBoCATIQAvD_BwE; ComponentLink3Description: Link Original; ComponentLink3URL: https://www.mouser.vn/ProductDetail/ABRACON/ABL-16000MHz-B4Y?qs=DZ%2FvJMgWWIsyUPmWNxNaQw%3D%3D&mgh=1&utm_id=21163026226&utm_source=google&utm_medium=cpc&utm_marketing_tactic=apaccorp&gad_source=1&gclid=CjwKCAiA2cu9BhBhEiwAft6IxAV0-pRf9DSp8GGx9s2dFs8XoHzeod-fZK3EKwYZPU6Ft0uHbqXBTBoCATIQAvD_BwE